# Altium project Eload Gen 3 Power Module.PrjPcb
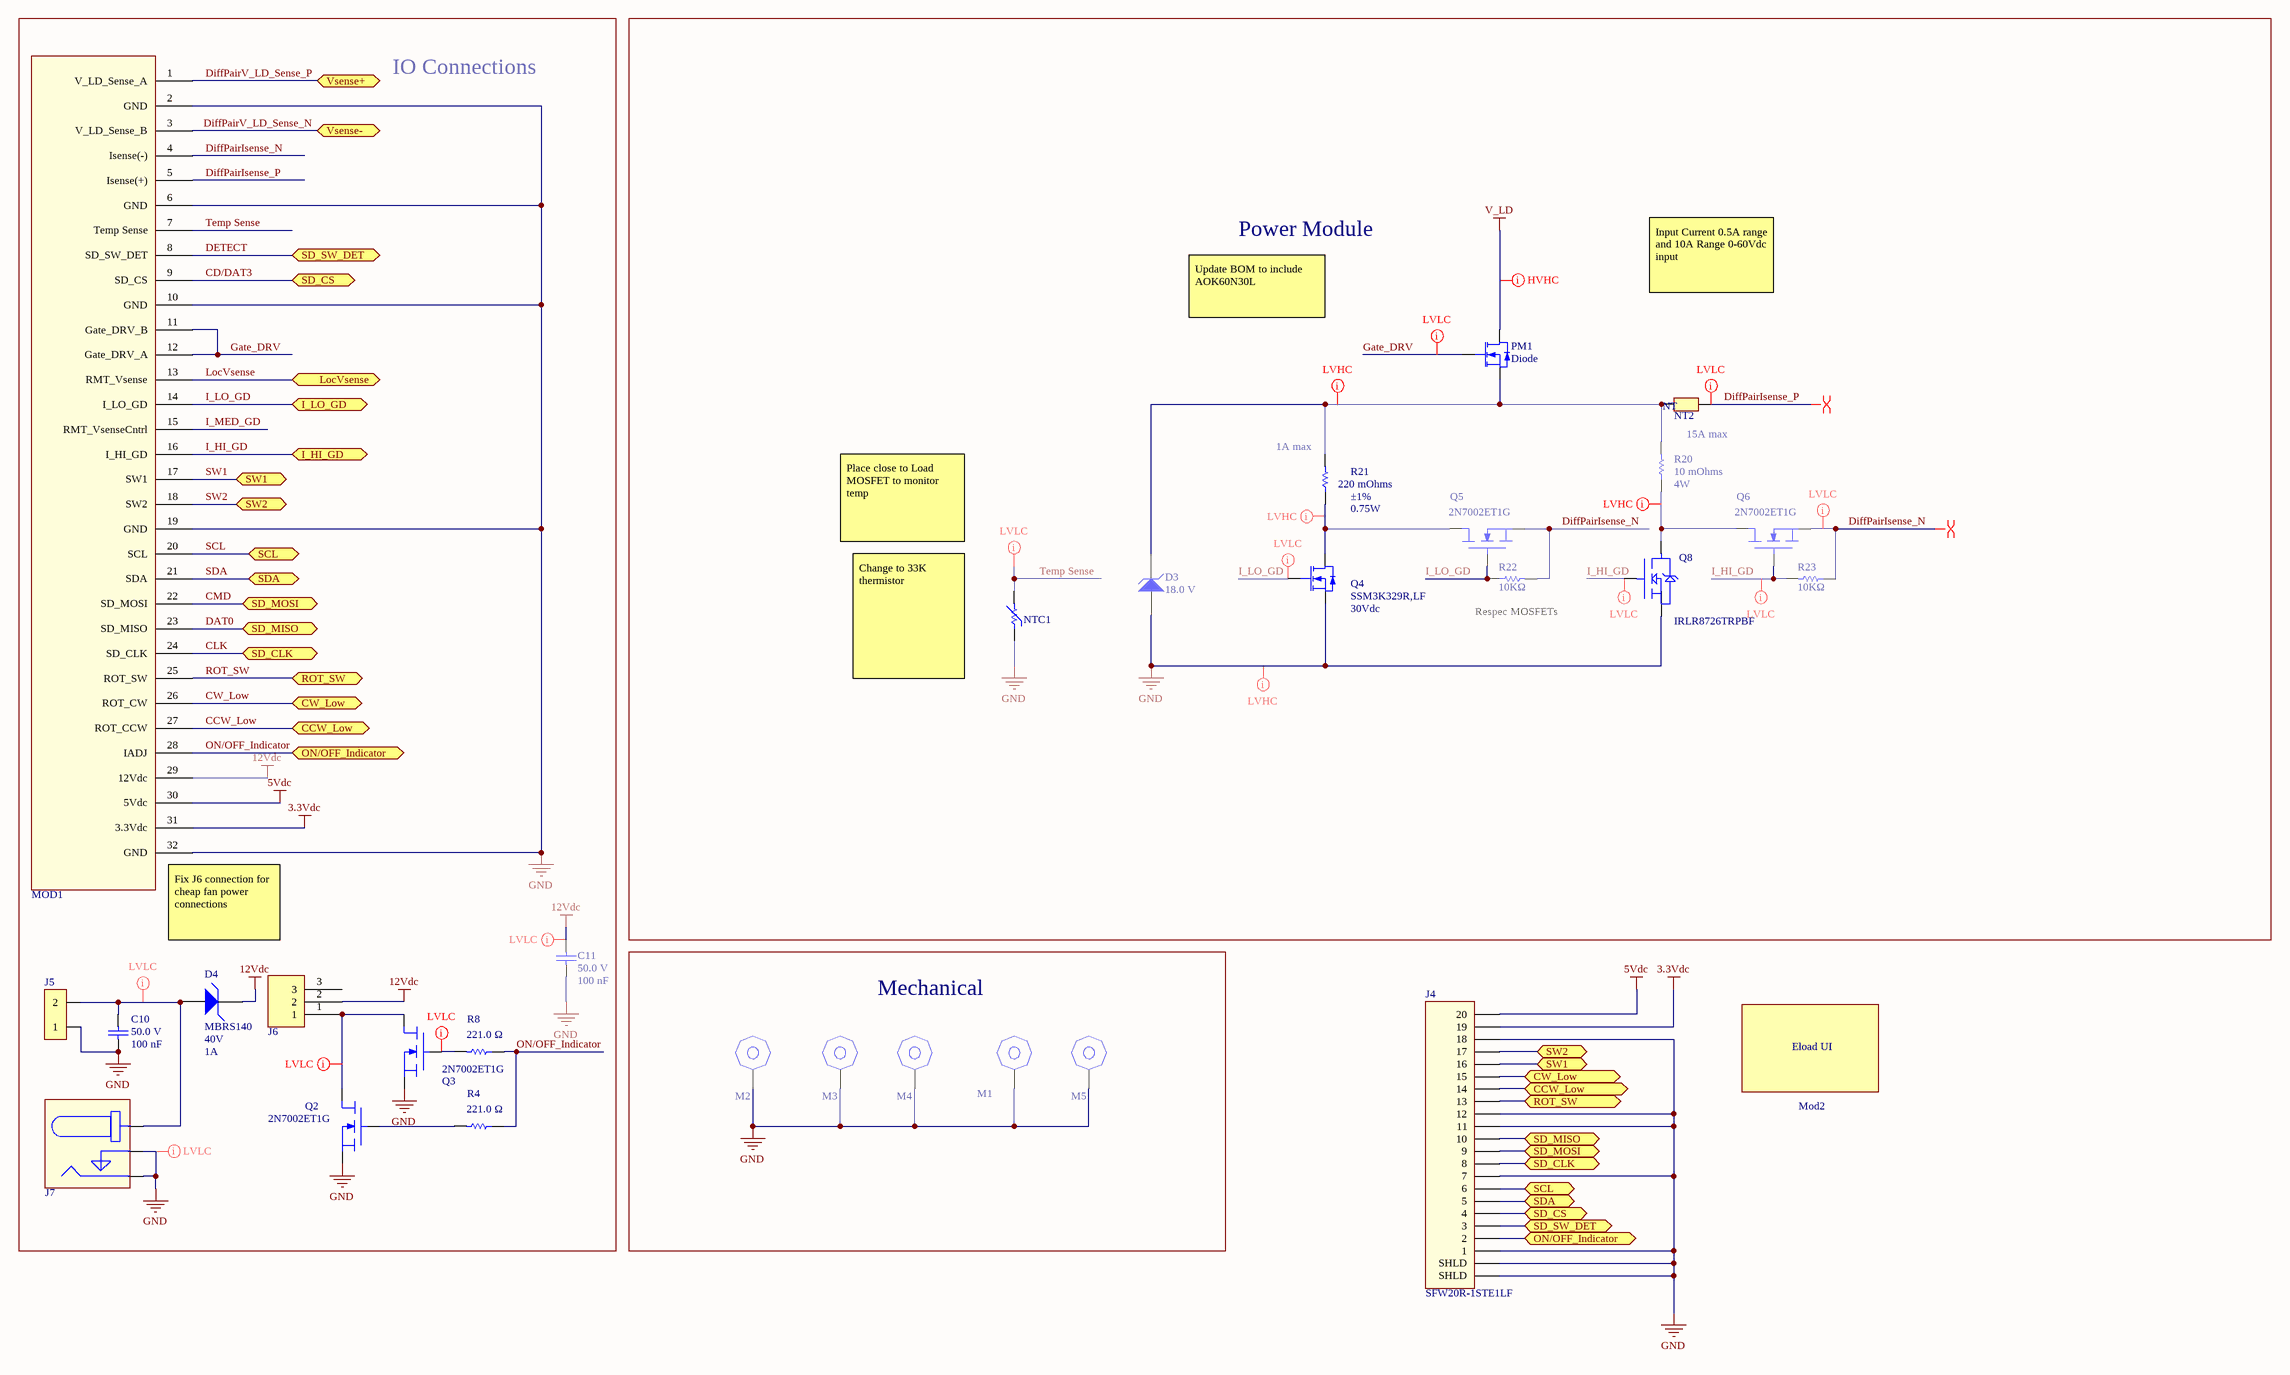
[diagram p0: Eload Gen 3 Power Module.SchDoc]
2 sheets, 40 parts. Net scope: flat (ports and power ports of the same name join across sheets).
Sheets:
  Eload Gen 3 Power Module.SchDoc
  Eload Gen 3 Power Module - Input Rev 2.SchDoc

## Sheet Eload Gen 3 Power Module.SchDoc
size C

### Parts
C10  Voltage Rating (DC): 50.0 V  Capacitance: 100 nF  [Cap,0805]  (hidden comment: 08055C104JAT2A)
C11  Voltage Rating (DC): 50.0 V  Capacitance: 100 nF  [Cap,0805]  (hidden comment: 08055C104JAT2A)
D3  Voltage Rating (DC): 18.0 V  [SOD123]  (hidden comment: MMSZ4705T1G)
D4  Voltage - DC Reverse (Vr) (Max): 40V  Current - Average Rectified (Io): 1A  [DO214AA]  (hidden comment: MBRS140)
J4  SFW20R-1STE1LF  [Connector,FlatFlex,20Pin,RA]
J5  TE Connectivity 282836-2  [TERM BLOCK 2POS SIDE ENTRY 5MM]  (value not drawn)
J6  2-644861-3  [Connector,TE,3-Pin,Male,Vert,2-644861-3]  (value not drawn)
J7  PJ-002A  [Connector,Barrel,2.1mm,5.5mm,DC power Jack]  (value not drawn)
M1  M3 hex Standoff  [Standoff,Hex,M3,8mm]  (value not drawn)
M2  M3 hex Standoff  [Standoff,Hex,M3,8mm]  (value not drawn)
M3  M3 hex Standoff  [Standoff,Hex,M3,8mm]  (value not drawn)
M4  M3 hex Standoff  [Standoff,Hex,M3,8mm]  (value not drawn)
M5  M3 hex Standoff  [Standoff,Hex,M3,8mm]  (value not drawn)
MOD1  Support PCBA  [Mod,ELoad Gen 3 Rev 1 Support]  (value not drawn)
Mod2  ELoad Gen 3 - User Interface - Rev 1  [Mod,Eload Gen 3- UI Rev 1 - Vertical]  (value not drawn)
NT2  Net Tie,0.254mm  [0.254mm Net Tie]  (value not drawn)  (net tie, no BOM)
NTC1  NTCLE100E3333JB0  [NTC,TH,2.54mm Lead Spacing,NTCLE100E3103JT2 -RA]  (value not drawn)
PM1  Diode  [Mod,Single TO-247-RA Horizontal CPU Cooler - LGBracket]
Q2  2N7002ET1G  [SOT23-3]
Q3  2N7002ET1G  [SOT23-3]
Q4  Drain to Source Voltage (Vdss): 30Vdc  [SOT23-3]  (hidden comment: SSM3K329R,LF)
Q5  2N7002ET1G  [SOT23-3]
Q6  2N7002ET1G  [SOT23-3]
Q8  IRLR8726TRPBF  [DPAK,3-Leads]
R4  Resistance: 221.0 Ω  [res, 0805, HD]  (hidden comment: Vishay Dale CRCW0805221RFKTA)
R8  Resistance: 221.0 Ω  [res, 0805, HD]  (hidden comment: Vishay Dale CRCW0805221RFKTA)
R20  Resistance: 10 mOhms  Power (Watts): 4W  [Res,2827,4W]  (hidden comment: CSSH2728FT10L0)
R21  Resistance: 220 mOhms  Tolerance: ±1%  Power (Watts): 0.75W  [Res,1206]  (hidden comment: KRL1632E-M-R220-F-T5)
R22  Resistance: 10KΩ  [res, 0805, HD]  (hidden comment: Vishay / Dale CRCW080510K0FKTA)
R23  Resistance: 10KΩ  [res, 0805, HD]  (hidden comment: Vishay / Dale CRCW080510K0FKTA)

### Blocks framed on the sheet
IO Connections: C10 C11 D4 J5-J7 MOD1 Q2 Q3 R4 R8
Power Module: D3 NT2 NTC1 PM1 Q4-Q6 Q8 R20-R23
Mechanical: M1-M5

### Ports
CCW_Low, CW_Low, I_HI_GD, I_LO_GD, LocVsense, ON/OFF_Indicator, ROT_SW, SCL, SD_CLK, SD_CS, SD_MISO, SD_MOSI, SD_SW_DET, SDA, SW1, SW2, Vsense+, Vsense-

### Nets
3.3Vdc: J4.19 MOD1.31(3.3Vdc)
5Vdc: J4.20 MOD1.30(5Vdc)
12Vdc: C11.2 D4.2 J6.2 MOD1.29(12Vdc)
GND: C10.1 C11.1 D3.2(A) J4.1 J4.7 J4.11 J4.12 J4.18 J4.21(SHLD) J4.22(SHLD) J5.1 J7.2 J7.3 M1.0 M2.0 M3.0 M4.0 M5.0 MOD1.2(GND) MOD1.6(GND) MOD1.10(GND) MOD1.19(GND) MOD1.32(GND) NTC1.1 Q2.2(S) Q3.2(S) Q4.2(S) Q8.2(Gate)
V_LD: PM1.2(D)
CCW_Low: J4.14 MOD1.27(ROT_CCW) ; port CCW_Low
CD/DAT3: J4.4 MOD1.9(SD_CS) ; port SD_CS
CLK: J4.8 MOD1.24(SD_CLK) ; port SD_CLK
CMD: J4.9 MOD1.22(SD_MOSI) ; port SD_MOSI
CW_Low: J4.15 MOD1.26(ROT_CW) ; port CW_Low
DAT0: J4.10 MOD1.23(SD_MISO) ; port SD_MISO
DETECT: J4.3 MOD1.8(SD_SW_DET) ; port SD_SW_DET
DiffPairIsense_N: MOD1.4(Isense(-)) Q5.2(S) Q6.2(S) R22.2 R23.1
DiffPairIsense_P: MOD1.5(Isense(+)) NT2.2
DiffPairV_LD_Sense_N: MOD1.3(V_LD_Sense_B) ; port Vsense-
DiffPairV_LD_Sense_P: MOD1.1(V_LD_Sense_A) ; port Vsense+
Gate_DRV: MOD1.11(Gate_DRV_B) MOD1.12(Gate_DRV_A) PM1.1(G)
I_HI_GD: MOD1.16(I_HI_GD) Q6.1(G) Q8.1(Gate) R23.2 ; port I_HI_GD
I_LO_GD: MOD1.14(I_LO_GD) Q4.1(G) Q5.1(G) R22.1 ; port I_LO_GD
I_MED_GD: MOD1.15(RMT_VsenseCntrl)
LocVsense: MOD1.13(RMT_Vsense) ; port LocVsense
ON/OFF_Indicator: J4.2 MOD1.28(IADJ) R4.1 R8.1 ; port ON/OFF_Indicator
ROT_SW: J4.13 MOD1.25(ROT_SW) ; port ROT_SW
SCL: J4.6 MOD1.20(SCL) ; port SCL
SDA: J4.5 MOD1.21(SDA) ; port SDA
SW1: J4.16 MOD1.17(SW1) ; port SW1
SW2: J4.17 MOD1.18(SW2) ; port SW2
Temp Sense: MOD1.7(Temp_Sense) NTC1.2
NetC10_2: C10.2 D4.1 J5.2 J7.1
NetD3_1: D3.1(K) NT2.1 PM1.3(S) R20.2 R21.2
NetJ6_1: J6.1 Q2.3(D) Q3.3(D)
NetQ2_1: Q2.1(G) R4.2
NetQ3_1: Q3.1(G) R8.2
NetQ4_3: Q4.3(D) Q5.3(D) R21.1
NetQ6_3: Q6.3(D) Q8.3(Gate) R20.1

Not connected (* = marked no-connect by the designer): J6 3

### Layout directives
net class Low Volt; net class High Current: GND, NetD3_1, NetQ4_3, NetQ6_3
net class Low Volt; net class Low Current: 12Vdc, DiffPairIsense_N, DiffPairIsense_P, Gate_DRV, GND, I_HI_GD, I_LO_GD, NetJ6_1, Temp Sense
net class Low Volt; net class Low Current; net class PwrRail: NetC10_2, NetQ3_1
differential pair: DiffPairIsense_N, DiffPairIsense_P
net class High Volt; net class High Current: V_LD

### Notes on the sheet
- Update BOM to include AOK60N30L
- Input Current 0.5A range and 10A Range 0-60Vdc input
- (near R21) 1A max
- 15A max
- Place close to Load MOSFET to monitor temp
- (near R22) Respec MOSFETs
- Change to 33K thermistor
- (near MOD1) Fix J6 connection for cheap fan power connections
- (in symbol Mod,Eload Gen 3 - USER INTERFACE - Rev 1) Eload UI
- (in symbol Net Tie,0.254mm) NT

### Library data of the parts
C10 C11 = Cap,0805,100nf,50V,5%,08055C104JAT2A: Capacitor; Ceramic; Cap 0.1 uF; Tol 5%; Vol-Rtg 50 VDC; SMT; 0805; X7R; Tape & Reel; Lead-Free Status: Lead Free; Case/Package (SI): 2012; Insulation Resistance: 100 GΩ; Detailed Description: 0.1µF ±5% 50V Ceramic Capacitor X7R 0805 (2012 Metric); Mounting Style: Surface Mount; Packaging: Tape & Reel (TR), Cut Tape (CT); RoHS: Compliant; Size-Width: 1.24 mm; Case/Package: 0805; Number of Pins: 2; digikey url: http://www.digikey.ca/product-detail/en/avx-corporation/08055C104JAT2A/478-3352-1-ND/930144; REACH SVHC Compliance: No SVHC; Dielectric Characteristic: X7R; Capacitance Tolerance: ±5%; Size-Length: 2.01 mm; Size-Height: 710 µm; Size-Thickness: 940 µm; Manufacturer Part Number: 08055C104JAT2A; Octopart URL: http://octopart.com/08055c104jat2a-avx-55388010; Operating Temperature: -55°C ~ 125°C; Supplier 1: Digi-Key; Supplier Part Number 1: 478-3352-1-ND
D3 = diode,Zener, 18V,500mW, SOD123,MMSZ4705T1G: Zener Diode 18V 500mW ±5% Surface Mount SOD-123; Manufacturer: ON Semiconductor; Lead-Free Status: Lead Free; Material: Plastic; Power Rating: 0.5 W; Current - Reverse Leakage @ Vr: 50nA @ 13.6V; Voltage - Forward (Vf) (Max) @ If: 900mV @ 10mA; Case/Package: SOD-123; Lifecycle Status: Active; Mounting Style: Surface Mount; Number of Pins: 2; REACH SVHC Compliance: No SVHC; RoHS: Compliant; Operating Temperature: -55°C ~ 150°C; mfg P/N: MMSZ4705T1G; Supplier 1: Digi-Key; Supplier Part Number 1: MMSZ4705T1GOSCT-ND
D4 = Diode,Schottky,40V,1A,SMB,MBRS140: DIODE SCHOTTKY 40V 1A SMB; Manufacturer: ON Semiconductor; Detailed Description: Diode Schottky 40V 1A Surface Mount SMB (DO-214AA); Categories: Discrete Semiconductor Products   Diodes - Rectifiers - Single; Voltage - Forward (Vf) (Max) @ If: 600mV @ 1A; Speed: Fast Recovery =< 500ns, > 200mA (Io); Current - Reverse Leakage @ Vr: 1mA @ 40V; Supplier 1: Digi-Key; Supplier Part Number 1: MBRS140FSTR-ND; Part Status: Active; Diode Type: Schottky; Mounting Type: Surface Mount; Package / Case: DO-214AA, SMB; Supplier Device Package: SMB (DO-214AA); Operating Temperature - Junction: -65°C ~ 125°C; Base Part Number: MBRS140; Supplier 2: LCSC; Supplier Part Number 2: C133091; mfg P/N: MBRS140
J4 = Connector,FFC,SMD,20Pin,1mmSpc,SFW20R-1STE1LF: CONN FFC BOTTOM 20POS 1.00MM R/A; Manufacturer: Amphenol ICC (FCI); Detailed Description: 20 Position FFC, FPC Connector Contacts, Bottom 0.039" (1.00mm) Surface Mount, Right Angle; Categories: Connectors, Interconnects   FFC, FPC (Flat Flexible) Connectors; Flat Flex Type: FFC, FPC; Connector/Contact Type: Contacts, Bottom; Number of Positions: 20; Pitch: 0.039" (1.00mm); FFC, FCB Thickness: 0.30mm, 0.33mm; Locking Feature: Slide Lock; Cable End Type: Straight, Tapered; Actuator Material: Polyphenylene Sulfide (PPS), Glass Filled; Voltage Rating: 100V; Material Flammability Rating: UL94 V-0; Current Rating (Amps): 1A; Actuator Color: Black; mfg P/N: SFW20R-1STE1LF; Mounting Type: Surface Mount, Right Angle; Termination: Solder; Height Above Board: 0.106" (2.70mm); Contact Material: Phosphor Bronze; Contact Finish: Tin; Housing Material: Polyphenylene Sulfide (PPS), Glass Filled; Features: Zero Insertion Force (ZIF); Operating Temperature: -55°C ~ 105°C; Housing Color: Brown; Mating Cycles: 20; Supplier 1: Digi-Key; Supplier Part Number 1: 609-1913-6-ND
J5 = TERM BLOCK 2POS SIDE ENTRY 5MM, 282836-2: Wire to Board 2 Position 5 mm Pitch 30-16 AWG Euro Style Terminal Block; Voltage Rating (AC): 250.0 V; ELV Compliant: Compliant; Current Rating: 13.5 A; Number of Contacts: 2; Pin Pitch: 0.005 m; Lead-Free Status: Lead Free; Wire Gauge: 15.0 AWG; RoHS: Compliant; Contact Material: Brass; Contact Plating: Tin; Color: Green; Manufacturer Part Number: 282836-2; Flammability Rating: UL 94 V-0; Mounting Style: PCB; Housing Material: Nylon 6/6; Insulation Material: Nylon; Housing Color: Green; Orientation: Right Angle; Lifecycle Status: Active; REACH SVHC Compliance: No SVHC; Number of Positions: 2; Supplier 1: TME; Supplier 2: Newark; Supplier 3: Digi-Key; Supplier 4: Digi-Key; Supplier Part Number 4: A98076-ND
J6 = Conntector, though hole, TE, 3pin, 2.54mm,2-644861-3: Connector Header Through Hole 3 position 0.100" (2.54mm); Insulation Resistance: 1.00 MΩ; Number of Contacts: 3; Number of Positions Loaded: All; Style: Board to Cable/Wire; Shrouding: Shrouded - 4 Wall; Contact Length - Mating: 0.200" (5.08mm); Contact Length - Post: 0.140" (3.56mm); Overall Contact Length: 0.440" (11.18mm); Material Flammability Rating: UL94 V-0; Current Rating (Amps): Varies by Wire Gauge; Voltage Rating: 250VAC; Number of Positions: 3; Connector Type: Header; Contact Type: Male Pin; Pitch - Mating: 0.100" (2.54mm); Number of Rows: 1; Mounting Type: Through Hole; Termination: Solder; Fastening Type: Friction Lock; Insulation Height: 0.410" (10.41mm); Contact Shape: Square; Contact Finish - Mating: Tin; Contact Finish - Post: Tin; Contact Material: Copper Alloy; Insulation Material: Polyester; Operating Temperature: -55°C ~ 105°C; Applications: General Purpose; Supplier 1: Digi-Key; Supplier Part Number 1: A30932-ND
J7 = Connector,Barrel,ID 2.1mm,OD 5.5mm,Power Connect, PJ-002A: Power Barrel Connector Jack 2.10mm ID (0.083"), 5.50mm OD (0.217") Through Hole, Right Angle; Manufacturer: CUI Inc.; Actual Diameter: 0.079" (2.00mm ID), 0.256" (6.50mm OD); Number of Positions/Contacts: 2 Conductors, 3 Contacts; Mating Length/Depth: 0.354" (9.00mm); Dielectric Material: Polybutylene Terephthalate (PBT); Internal Switch(s): Does Not Contain Switch; Shielding: Unshielded; Voltage - Rated: 24VDC; Current Rating (Amps): 2.5A; Material Flammability Rating: UL94 V-0; Body Color: Black; mfg P\N: PJ-002A; Industry Recognized Mating Diameter: 2.10mm ID (0.083"), 5.50mm OD (0.217"); Connector Type: Jack; Mounting Type: Through Hole, Right Angle; Termination: Solder Eyelet(s); Contact Material - Plating: Tin; Operating Temperature: -25°C ~ 85°C; Contact Material: Brass, Copper Alloy; Supplier 1: Digi-Key; Supplier Part Number 1: CP-002A-ND
M1-M5 = Standoff, M3, Hex: HEX STANDOFF M3,generic
MOD1 = Mod,Eload Gen 3 Control rev 1
Mod2 = Mod,Eload Gen 3 - USER INTERFACE - Rev 1: Mod, ELoad Gen 3 - User Interface - Rev 1
NTC1 = Sensor,Temp,NTC,33Kohm,±1.5%, NTCLE100E3333JB0: THERMISTOR NTC 33KOHM 4090K BEAD; Manufacturer: Vishay BC Components; Detailed Description: NTC Thermistor 10k Bead; Categories: Sensors, Transducers   Temperature Sensors - NTC Thermistors; Resistance in Ohms @ 25°C: 33k; Resistance Tolerance: ±5%; B Value Tolerance: ±1.5%; Power - Max: 500mW; mfg P/N: NTCLE100E3333JB0; Part Status: Active; B25/85: 4090K; Operating Temperature: -40°C ~ 125°C; Length - Lead Wire: 0.59" (15.00mm); Mounting Type: Through Hole; Package / Case: Bead; Supplier 1: Digi-Key; Supplier Part Number 1: BC2308-ND
PM1 = MOD, Singal Mosfet with Heatsink: Singal RA Mosfet TO-247 with CPU cooler; Mosfets: IXYS IXTH30N60L2; Cooling assembly: Hyper T2
Q2 Q3 Q5 Q6 = MOSFET,N-Channel,SOT23,0.25A,60V,2N7002ET1G: Small Signal MOSFET, 60 V, 310 mA, Single, N-Channel, 3-Pin SOT-23, Pb-Free, Tape and Reel; Manufacturer: ON Semiconductor; Continuous Drain Current (Ids): 0.25A; Lead-Free Status: Lead Free; Drain to Source Voltage (Vds): 60.0 V; Power Dissipation (Max): 350mW (Ta); REACH SVHC Compliance: No SVHC; Number of Pins: 3; Halogen Free Status: Halogen Free; Case/Package: SOT-23-3; Polarity: N-Channel; RoHS: Compliant; Lifecycle Status: Active; Supplier 1: Digi-Key; Supplier Part Number 1: 2N7002ET1GOSCT-ND; Supplier 2: LCSC; Supplier Part Number 2: C71533; Manufacturer Part Number: 2N7002ET1G
Q4 = MOSFET.N-Chan, SOT-23-3,3.5A,30V,1W,SSM3K329R,LF: N-Channel 30V 3.5A (Ta) 1W (Ta) Surface Mount SOT-23F; Lead-Free Status: Lead Free; Technology MOSFET: (Metal Oxide); Drive Voltage (Max Rds On, Min Rds On): 1.8V, 4V; Rds On (Max) @ Id, Vgs: 126 mOhm @ 1A, 4V; Vgs(th) (Max) @ Id: 1V @ 1mA; Gate Charge (Qg) (Max) @ Vgs: 1.5nC @ 4V; Vgs (Max): ±12V; Input Capacitance (Ciss) (Max) @ Vds: 123pF @ 15V; RoHS: Compliant; REACH SVHC Compliance: No SVHC; Mounting Style: Surface Mount; Lifecycle Status: Active; Current - Continuous Drain (Id) @ 25°C: 3.5A; Power Dissipation (Max): 1W; FET Type: N-Channel; Operating Temperature: 150°C (TJ); Mounting Type: Surface Mount; Supplier Device Package: SOT-23F; Package / Case: SOT-23-3  Flat Leads; mfg P/N: SSM3K329R,LF; Supplier 1: Digi-Key; Supplier Part Number 1: SSM3K329RLFDKR-ND
Q8 = MOSFET, N-Chan, Dpak, 30V, 86A, 75W, IRLR8726TRPBF: N-Channel 30V 86A (Tc) 75W (Tc) Surface Mount D-Pak; Manufacturer: Infineon Technologies; Rds On (Max) @ Id, Vgs: 5.8mOhm @ 25A, 10V; Gate Charge (Qg) (Max) @ Vgs: 23nC @ 4.5V; Categories: Discrete Semiconductor Products   Transistors - FETs, MOSFETs - Single; Drive Voltage (Max Rds On, Min Rds On): 4.5V, 10V; Vgs(th) (Max) @ Id: 2.35V @ 50µA; Vgs (Max): ±20V; Input Capacitance (Ciss) (Max) @ Vds: 2150pF @ 15V; Detailed Description: N-Channel 30V 86A (Tc) 75W (Tc) Surface Mount D-Pak; Series: HEXFET®; FET Type: N-Channel; Supplier Device Package: D-Pak; mfg P/N: IRLR8726TRPBF; Part Status: Active; Technology: MOSFET (Metal Oxide); Drain to Source Voltage (Vdss): 30V; Current - Continuous Drain (Id) @ 25°C: 86A (Tc); Power Dissipation (Max): 75W (Tc); Operating Temperature: -55°C ~ 175°C (TJ); Mounting Type: Surface Mount; Package / Case: TO-252-3, DPak (2 Leads + Tab), SC-63; Supplier 1: LCSC; Supplier Part Number 1: C81137; Supplier 2: Digi-Key; Supplier Part Number 2: IRLR8726TRPBFCT-ND
R4 R8 = Res,0805,221Ω,1%,100ppm,CRCW0805221RFKTA: RES SMD 221 OHM 1% 1/8W 0805; Case/Package (SI): 2012; Lead-Free Status: Contains Lead; Power Dissipation: 0.125 W; Temperature Coefficient: 100.0 ppm/°C; Voltage Rating (DC): 150.0 V; Case/Package: 0805; Mounting Style: Surface Mount; Number of Pins: 2; Power Rating: 0.125 W; Resistance Tolerance: ±1%; RoHS: Non-Compliant; Size-Height: 0.00045 m; Size-Length: 0.002 m; Size-Width: 0.00125 m; Supplier 1: Digi-Key; Supplier Part Number 1: 541-221CCT-ND
R20 = Res,2827,shunt,10mΩ,1%,15ppm,CSSH2728FT10L0: 10 mOhms ±1% 4W Chip Resistor Wide 2827 (7067 Metric), 2728 Automotive AEC-Q200, Current Sense Metal Foil; Temperature Coefficient: ±15ppm/°C; Other Names: CSSH 2728 0.01 1% R   CSSH27280.011%RTR   CSSH27280.011%RTR-ND   CSSH27280.01FRTR   CSSH27280.01FRTR-ND   CSSH2728FT10L0TR; mfg P/N: CSSH2728FT10L0; Tolerance: ±1%; Composition: Metal Foil; Features: Automotive AEC-Q200, Current Sense; Operating Temperature: -55°C ~ 225°C; Package / Case: Wide  2827 (7067 Metric), 2728
R21 = Res,1206,0.22Ohm,1%,0.75W,50ppm,KRL1632E-M-R220-F-T5: RES 0.22 OHM 1% 3/4W 1206; Manufacturer: Susumu; Detailed Description: 220 mOhms ±1% 0.75W, 3/4W Chip Resistor 1206 (3216 Metric) Automotive AEC-Q200, Current Sense Metal Foil; mfg P/N: KRL1632E-M-R220-F-T5; Part Status: Active; Composition: Metal Foil; Features: Automotive AEC-Q200, Current Sense; Temperature: Coefficient ±50ppm/°C; Operating Temperature: -55°C ~ 155°C; Package / Case: 1206 (3216 Metric); Supplier Device Package: 1206; Size / Dimension: 0.126" L x 0.063" W (3.20mm x 1.60mm); Height - Seated (Max): 0.028" (0.70mm); Number of Terminations: 2
R22 R23 = Res,0805,10.0kΩ,1%,100 ppm,CRCW080510K0FKTA: RES SMD 10K OHM 1% 1/8W 0805; Temperature Coefficient: 100.0 ppm/C; Lead-Free Status: Contains Lead; Voltage Rating (DC): 150.0 V; Power Rating: 0.125 W; Case/Package (SI): 2012; Size-Width: 0.00125 m; Resistance Tolerance: 1%; Size-Length: 0.002 m; RoHS: Non-Compliant; Power Dissipation: 0.125 W; Number of Pins: 2; REACH SVHC Compliance: No SVHC; Size-Height: 0.00045 m; Case/Package: 0805; Mounting Style: Surface Mount; Supplier 1: Digi-Key; Supplier Part Number 1: 541-3016-1-ND

## Sheet Eload Gen 3 Power Module - Input Rev 2.SchDoc
size A
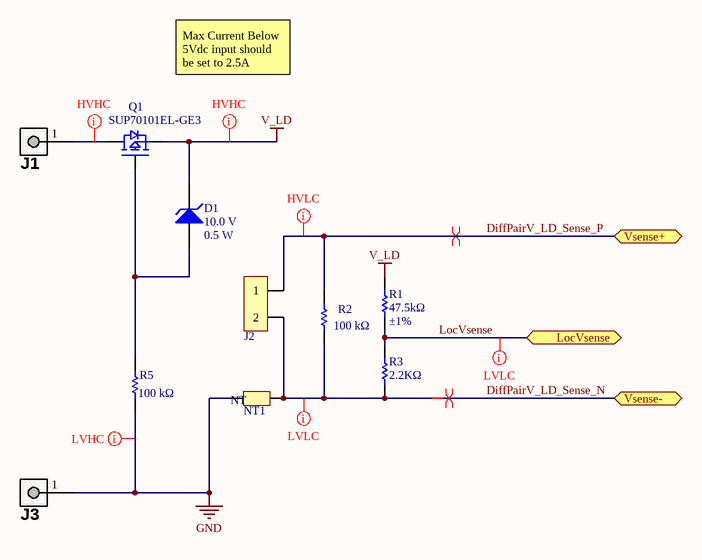
[diagram p1: Eload Gen 3 Power Module - Input Rev 2.SchDoc]

### Parts
D1  Breakdown Voltage: 10.0 V  Power Rating: 0.5 W  [SOD123]  (hidden comment: MMSZ5240BT1G)
J1  wire teminal, lugs, screw, Keystone 8197  [Keystone 8197]  (value not drawn)
J2  TE Connectivity 282836-2  [TERM BLOCK 2POS SIDE ENTRY 5MM]  (value not drawn)
J3  wire teminal, lugs, screw, Keystone 8197  [Keystone 8197]  (value not drawn)
NT1  Net Tie,0.254mm  [0.254mm Net Tie]  (value not drawn)  (net tie, no BOM)
Q1  SUP70101EL-GE3  [TO-220 RA]
R1  Resistance: 47.5kΩ  Tolerance: ±1%  [res, 0805, HD]  (hidden comment: RK73H2ATTD4752F)
R2  Resistance: 100 kΩ  [res, 0805, HD]  (hidden comment: CRCW0805100KFKEA)
R3  Resistance: 2.2KΩ  [res, 0805, HD]  (hidden comment: CRCW08052K20FKEA)
R5  Resistance: 100 kΩ  [res, 0805, HD]  (hidden comment: CRCW0805100KFKEA)

### Ports
LocVsense, Vsense+, Vsense-

### Nets
GND: J3.1 NT1.1 R5.1
V_LD: D1.1(K) Q1.3(Source) R1.2
DiffPairV_LD_Sense_N: J2.2 NT1.2 R2.1 R3.1 ; port Vsense-
DiffPairV_LD_Sense_P: J2.1 R2.2 ; port Vsense+
LocVsense: R1.1 R3.2 ; port LocVsense
NetD1_2: D1.2(A) Q1.1(Gate) R5.2
NetJ1_1: J1.1 Q1.2(Drain)

### Layout directives
net class Low Volt; net class Low Current; net class PwrRail: DiffPairV_LD_Sense_N, LocVsense
net class High Volt; net class High Current: NetJ1_1, V_LD
net class Low Volt; net class High Current: GND
differential pair: DiffPairV_LD_Sense_N, DiffPairV_LD_Sense_P
net class High Volt; net class Low Current: DiffPairV_LD_Sense_P

### Notes on the sheet
- Max Current Below 5Vdc input should be set to 2.5A
- (in symbol Net Tie,0.254mm) NT

### Library data of the parts
D1 = Diode, Zener,SOD-123,10V,500mW, MMSZ5240BT1G: Zener Voltage Regulator, 500 mW, 2-Pin SOD-123, Pb-Free, Tape and Reel; Lead-Free Status: Lead Free; Material: Plastic; Case/Package: SOD-123; Lifecycle Status: Active; Mounting Style: Surface Mount; Number of Pins: 2; REACH SVHC Compliance: No SVHC; RoHS: Compliant; Voltage Rating (DC): 10.0 V; Supplier 1: Digi-Key; Supplier Part Number 1: MMSZ5240BT1GOSCT-ND; Supplier 2: LCSC; Supplier Part Number 2: C82084
J1 J3 = wire teminal, lugs, screw, Keystone 8197: WRIGHT TOOL 8197 Socket, 1 In Dr, 3-1/8 In, 12 Pt, Std. More details: Socket, Drive Size 1 In., Number of Points 12, ...; Manufacturer Part Number: 8197; Current Rating: 30.0 A; Pin Pitch: 0.0020066 m; Lead-Free Status: Lead Free; Number of Contacts: 6; Gender: Male; REACH SVHC Compliance: No SVHC; Orientation: Straight; Contact Material: Brass; Size-Height: 0.011684 m; Contact Plating: Tin; Number of Rows: 2; RoHS: Compliant; Mounting Style: Snap-In, PCB; Termination Style: Screw; Supplier 1: Digi-Key; Supplier Part Number 1: 36-8197-ND; Supplier 2: Digi-Key; Supplier Part Number 2: 36-8197-2-ND; Supplier 3: Digi-Key; Supplier Part Number 3: 36-8197-3-ND; Supplier 4: LCSC; Supplier Part Number 4: C238177
J2 = TERM BLOCK 2POS SIDE ENTRY 5MM, 282836-2: as J5 on sheet Eload Gen 3 Power Module; RoHS: Compliant; Contact Material: Brass; Contact Plating: Tin; Color: Green; Manufacturer Part Number: 282836-2; Flammability Rating: UL 94 V-0; Mounting Style: PCB; Housing Material: Nylon 6/6; Insulation Material: Nylon; Housing Color: Green; Orientation: Right Angle; Lifecycle Status: Active; REACH SVHC Compliance: No SVHC; Number of Positions: 2; Supplier 1: TME; Supplier 2: Newark; Supplier 3: Digi-Key; Supplier 4: Digi-Key; Supplier Part Number 4: A98076-ND
Q1 = MOSFET,P-Chan,100V,120A,TO220, SUP70101EL-GE3: MOSFET P-CH 100V 120A TO220AB; Manufacturer: Vishay Siliconix; mfg P/N: SQM50P08-25L_GE3; Detailed Description: P-Channel 100V 120A (Tc) 375W (Tc) Through Hole TO-220AB; Categories: Discrete Semiconductor Products; Current - Continuous Drain (Id) @ 25°C: 120A (Tc); Drive Voltage (Max Rds On, Min Rds On): 4.5V, 10V; Rds On (Max) @ Id, Vgs: 10mOhm; Gate Charge (Qg) (Max) @ Vgs: 190nC @ 10V; Vgs (Max): ±20V; Input Capacitance: 7000pF @ 50V; Power Dissipation (Max): 375W (Tc); Vgs(th) (Max) @ Id: 2.5V @ 250µA; FET Type: P-Channel; Series: Automotive, AEC-Q101, TrenchFET®; Part Status: Active; Technology: MOSFET (Metal Oxide); Drain to Source Voltage (Vdss): 100V; Operating Temperature: -55°C ~ 175°C (TJ); Mounting Type: Through Hole; Supplier Device Package: TO-220AB; Package / Case: TO-220-3; Supplier 1: Digi-Key; Supplier Part Number 1: SUP70101EL-GE3-ND
R1 = Res,0805,47.5KΩ,1%,100ppm,RK73H2ATTD4752F: 47.5 kOhms ±1% 0.25W, 1/4W Chip Resistor 0805 (2012 Metric) Automotive AEC-Q200, Moisture Resistant Thick Film; Manufacturer: KOA Speer Electronics, Inc.; Temperature Coefficient: ±100ppm/°C; Detailed Description: 47.5 kOhms ±1% 0.25W, 1/4W Chip Resistor 0805 (2012 Metric) Automotive AEC-Q200, Moisture Resistant Thick Film; mfg P/N: RK73H2ATTD4752F; Power (Watts): 0.25W, 1/4W; Composition: Thick Film; Features: Automotive AEC-Q200, Moisture Resistant; Operating Temperature: -55°C ~ 155°C; Package / Case 0805: (2012 Metric); Supplier Device Package: 0805; Size / Dimension: 0.079" L x 0.049" W (2.00mm x 1.25mm); Height - Seated (Max): 0.024" (0.60mm); Number of Terminations: 2; Supplier 1: Digi-Key; Supplier Part Number 1: 2019-RK73H2ATTD4752FCT-ND
R2 R5 = Res,0805,100kΩ,1%,100ppm,CRCW0805100KFKEA: 100 kOhms ±1% 0.125W, 1/8W Chip Resistor 0805 (2012 Metric) Thick Film; Manufacturer: Vishay; Lead-Free Status: Lead Free; Case/Package (SI): 2012; Power Rating: 125 mW; Temperature Coefficient: -100 ppm/°C to 100 ppm/°C; Resistance Tolerance: ±1%; RoHS: Compliant; Manufacturer Part Number: CRCW0805100KFKEA; Number of Pins: 2; Size-Length: 2.00 mm; Packaging: Tape & Reel (TR), Reel, Cut Tape (CT); Size-Height: 450 µm; Case/Package: 0805; Size-Width: 1.25 mm; Operating Temperature: 150 °C (max); Supplier 1 Part Number: 679-0803; Supplier 1: RS; Supplier 2: Digi-Key; Supplier Part Number 2: 541-100KCCT-ND
R3 = Res,0805,2.2KΩ,±1%,100.0 ppm/°C,150.0 V,CRCW08052K20FKEA: RES SMD 2.2K OHM 1% 1/8W 0805; Case/Package (SI): 2012; Lead-Free Status: Lead Free; Power Rating: 0.125 W; Voltage Rating (DC): 150.0 V; Case/Package: 0805; Mounting Style: Surface Mount; Number of Pins: 2; REACH SVHC Compliance: No SVHC; Resistance Tolerance: ±1%; RoHS: Compliant; Size-Height: 0.00045 m; Size-Length: 0.002 m; Size-Width: 0.00125 m; Temperature Coefficient: 100.0 ppm/°C; mfg P/N: CRCW08052K20FKEA; Supplier 1: Digi-Key; Supplier Part Number 1: 541-2.20KCCT-ND

## Nets that join several sheets
GND: Eload Gen 3 Power Module (28 pins), Eload Gen 3 Power Module - Input Rev 2 (J3.1 NT1.1 R5.1)
V_LD: Eload Gen 3 Power Module (PM1.2), Eload Gen 3 Power Module - Input Rev 2 (D1.1 Q1.3 R1.2)
DiffPairV_LD_Sense_N: Eload Gen 3 Power Module (MOD1.3), Eload Gen 3 Power Module - Input Rev 2 (J2.2 NT1.2 R2.1 R3.1)
DiffPairV_LD_Sense_P: Eload Gen 3 Power Module (MOD1.1), Eload Gen 3 Power Module - Input Rev 2 (J2.1 R2.2)
LocVsense: Eload Gen 3 Power Module (MOD1.13), Eload Gen 3 Power Module - Input Rev 2 (R1.1 R3.2)